# Altium project VCS_Git_Test.PrjPcb
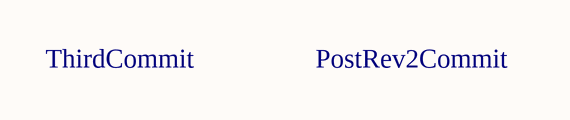
[diagram p0: VCS_Git_Test_r2.SchDoc]
3 sheets, 2 parts. Net scope: global (net labels, ports and power ports of the same name join across sheets).
Board file: VCS_Git_Test.PcbDoc
Sheets:
  VCS_Git_Test_r2.SchDoc
  File2.SchDoc
  FileTwo.SchDoc

## Sheet VCS_Git_Test_r2.SchDoc
size A4; SheetNumber: 1; SheetTotal: 1

### Notes on the sheet
- ThirdCommit
- PostRev2Commit

## Sheet File2.SchDoc
size A4; SheetNumber: 2; SheetTotal: 4
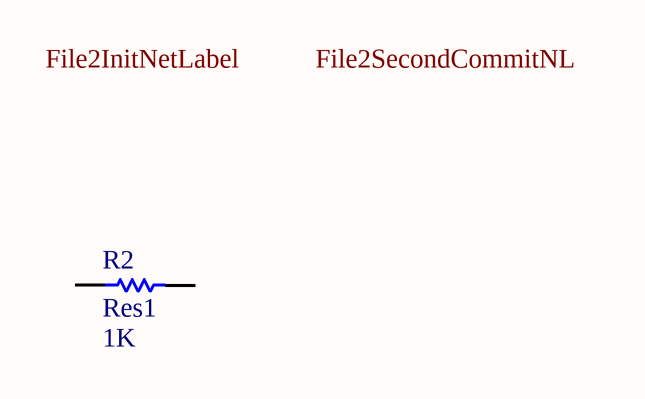
[diagram p1: File2.SchDoc]

### Parts
(Parts that share a designator on the sheet are numbered #1, #2 ... from top to bottom, then left to right.)
R2#1  Res1  value 1K  [AXIAL-0.3]

### Nets

Not connected (* = marked no-connect by the designer): R2#1 1 2

### Notes on the sheet
- Labels drawn without touching a wire or pin: File2InitNetLabel, File2SecondCommitNL

### Library data of the parts
R2#1 = Res1: Resistor; Published: 8-Jun-2000; LatestRevisionDate: 17-Jul-2002; LatestRevisionNote: Re-released for DXP Platform.; PackageReference: AXIAL-0.3; Publisher: Altium Limited; PackageDescription: Axial Device, Thru-Hole; 2 Leads; 0.3 in Pin Spacing

## Sheet FileTwo.SchDoc
size A4; SheetNumber: 4; SheetTotal: 8
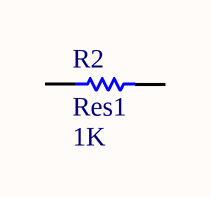
[diagram p2: FileTwo.SchDoc]

### Parts
(Parts that share a designator on the sheet are numbered #1, #2 ... from top to bottom, then left to right.)
R2#2  Res1  value 1K  [AXIAL-0.3]

### Nets

Not connected (* = marked no-connect by the designer): R2#2 1 2

### Library data of the parts
R2#2 = Res1: Resistor; Published: 8-Jun-2000; LatestRevisionDate: 17-Jul-2002; LatestRevisionNote: Re-released for DXP Platform.; PackageReference: AXIAL-0.3; Publisher: Altium Limited; PackageDescription: Axial Device, Thru-Hole; 2 Leads; 0.3 in Pin Spacing